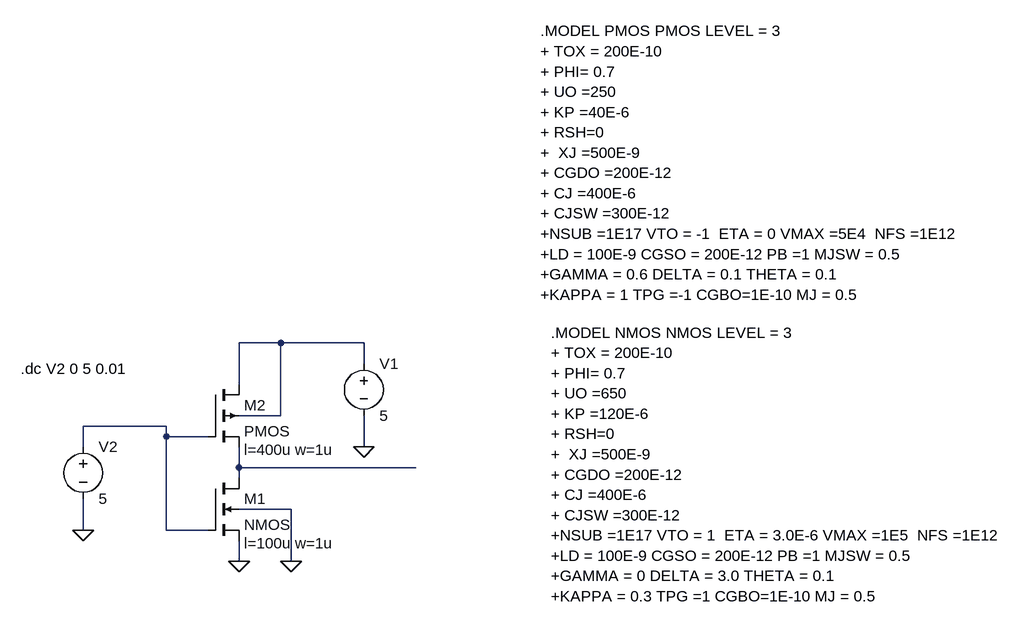
[diagram p0: schematic CMOS_Inverter.asc]
CMOS_Inverter.asc, the LTspice schematic file:
Version 4
SHEET 1 1480 680
WIRE 320 -16 256 -16
WIRE 448 -16 320 -16
WIRE 448 16 448 -16
WIRE 256 48 256 -16
WIRE 320 96 320 -16
WIRE 320 96 256 96
WIRE 144 112 16 112
WIRE 144 128 144 112
WIRE 208 128 144 128
WIRE 16 144 16 112
WIRE 448 144 448 96
WIRE 256 176 256 144
WIRE 528 176 256 176
WIRE 256 192 256 176
WIRE 336 240 256 240
WIRE 16 272 16 224
WIRE 144 272 144 128
WIRE 208 272 144 272
WIRE 256 320 256 288
WIRE 336 320 336 240
FLAG 16 272 0
FLAG 256 320 0
FLAG 336 320 0
FLAG 448 144 0
SYMBOL nmos4 208 192 R0
WINDOW 123 56 100 Left 2
SYMATTR Value2 l=100u w=1u
SYMATTR InstName M1
SYMBOL pmos4 208 48 R0
WINDOW 123 56 100 Left 2
SYMATTR Value2 l=400u w=1u
SYMATTR InstName M2
SYMBOL voltage 448 0 R0
WINDOW 123 0 0 Left 0
WINDOW 39 0 0 Left 0
SYMATTR InstName V1
SYMATTR Value 5
SYMBOL voltage 16 128 R0
WINDOW 123 0 0 Left 0
WINDOW 39 0 0 Left 0
SYMATTR InstName V2
SYMATTR Value 5
TEXT 736 -32 Left 2 !.MODEL NMOS NMOS LEVEL = 3\n+ TOX = 200E-10\n+ PHI= 0.7\n+ UO =650\n+ KP =120E-6\n+ RSH=0\n+  XJ =500E-9\n+ CGDO =200E-12\n+ CJ =400E-6\n+ CJSW =300E-12\n+NSUB =1E17 VTO = 1  ETA = 3.0E-6 VMAX =1E5  NFS =1E12\n+LD = 100E-9 CGSO = 200E-12 PB =1 MJSW = 0.5\n+GAMMA = 0 DELTA = 3.0 THETA = 0.1\n+KAPPA = 0.3 TPG =1 CGBO=1E-10 MJ = 0.5
TEXT -80 24 Left 2 !.dc V2 0 5 0.01
TEXT 720 -496 Left 2 !.MODEL PMOS PMOS LEVEL = 3\n+ TOX = 200E-10\n+ PHI= 0.7\n+ UO =250\n+ KP =40E-6\n+ RSH=0\n+  XJ =500E-9\n+ CGDO =200E-12\n+ CJ =400E-6\n+ CJSW =300E-12\n+NSUB =1E17 VTO = -1  ETA = 0 VMAX =5E4  NFS =1E12\n+LD = 100E-9 CGSO = 200E-12 PB =1 MJSW = 0.5\n+GAMMA = 0.6 DELTA = 0.1 THETA = 0.1\n+KAPPA = 1 TPG =-1 CGBO=1E-10 MJ = 0.5

The netlist it stands for:
* CMOS_Inverter.asc
M1 N003 N002 0 0 NMOS l=100u w=1u
M2 N001 N002 N003 N001 PMOS l=400u w=1u
V1 N001 0 5
V2 N002 0 5
.model NMOS NMOS
.model PMOS PMOS
.lib standard.mos
.MODEL NMOS NMOS LEVEL = 3
+ TOX = 200E-10
+ PHI= 0.7
+ UO =650
+ KP =120E-6
+ RSH=0
+  XJ =500E-9
+ CGDO =200E-12
+ CJ =400E-6
+ CJSW =300E-12
+NSUB =1E17 VTO = 1  ETA = 3.0E-6 VMAX =1E5  NFS =1E12
+LD = 100E-9 CGSO = 200E-12 PB =1 MJSW = 0.5
+GAMMA = 0 DELTA = 3.0 THETA = 0.1
+KAPPA = 0.3 TPG =1 CGBO=1E-10 MJ = 0.5
.dc V2 0 5 0.01
.MODEL PMOS PMOS LEVEL = 3
+ TOX = 200E-10
+ PHI= 0.7
+ UO =250
+ KP =40E-6
+ RSH=0
+  XJ =500E-9
+ CGDO =200E-12
+ CJ =400E-6
+ CJSW =300E-12
+NSUB =1E17 VTO = -1  ETA = 0 VMAX =5E4  NFS =1E12
+LD = 100E-9 CGSO = 200E-12 PB =1 MJSW = 0.5
+GAMMA = 0.6 DELTA = 0.1 THETA = 0.1
+KAPPA = 1 TPG =-1 CGBO=1E-10 MJ = 0.5
.backanno
.end

* Results of the author's LTspice run, read from the files saved beside the schematic
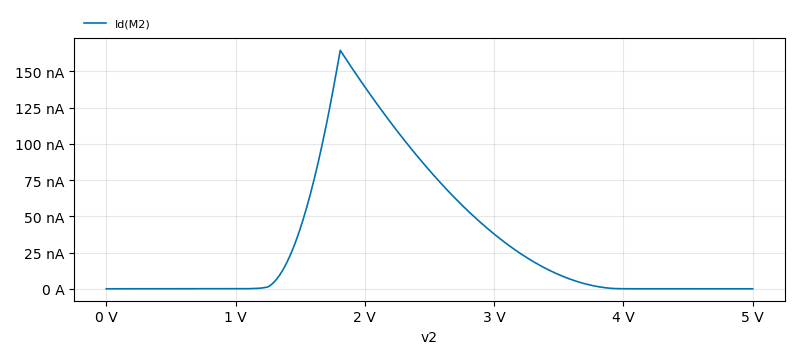
[diagram p1: DC transfer characteristic of CMOS_Inverter.asc, plotted from the saved traces]
* DC transfer characteristic, 1 run:
*   Id(M2): 9.869 pA at v2=0 V, 5 pA at v2=5 V, min 5 pA, max 164.4 nA